# EasyEDA Pro project ProPrj_Rak11310v3b_2025-04-18.epro, schematic Schematic1
Board Name: Board1; Create Date: 2025-02-04; Page Name: P2; Project Name: Rak11310v3b; Schematic Name: Schematic1; Update Date: 2025-03-11; Company: EasyEDA.com; Drawn: EasyEDA; Page Size: A4; Part Number: JLCPCB-002; Reviewed: EasyEDA; Version: V0.1
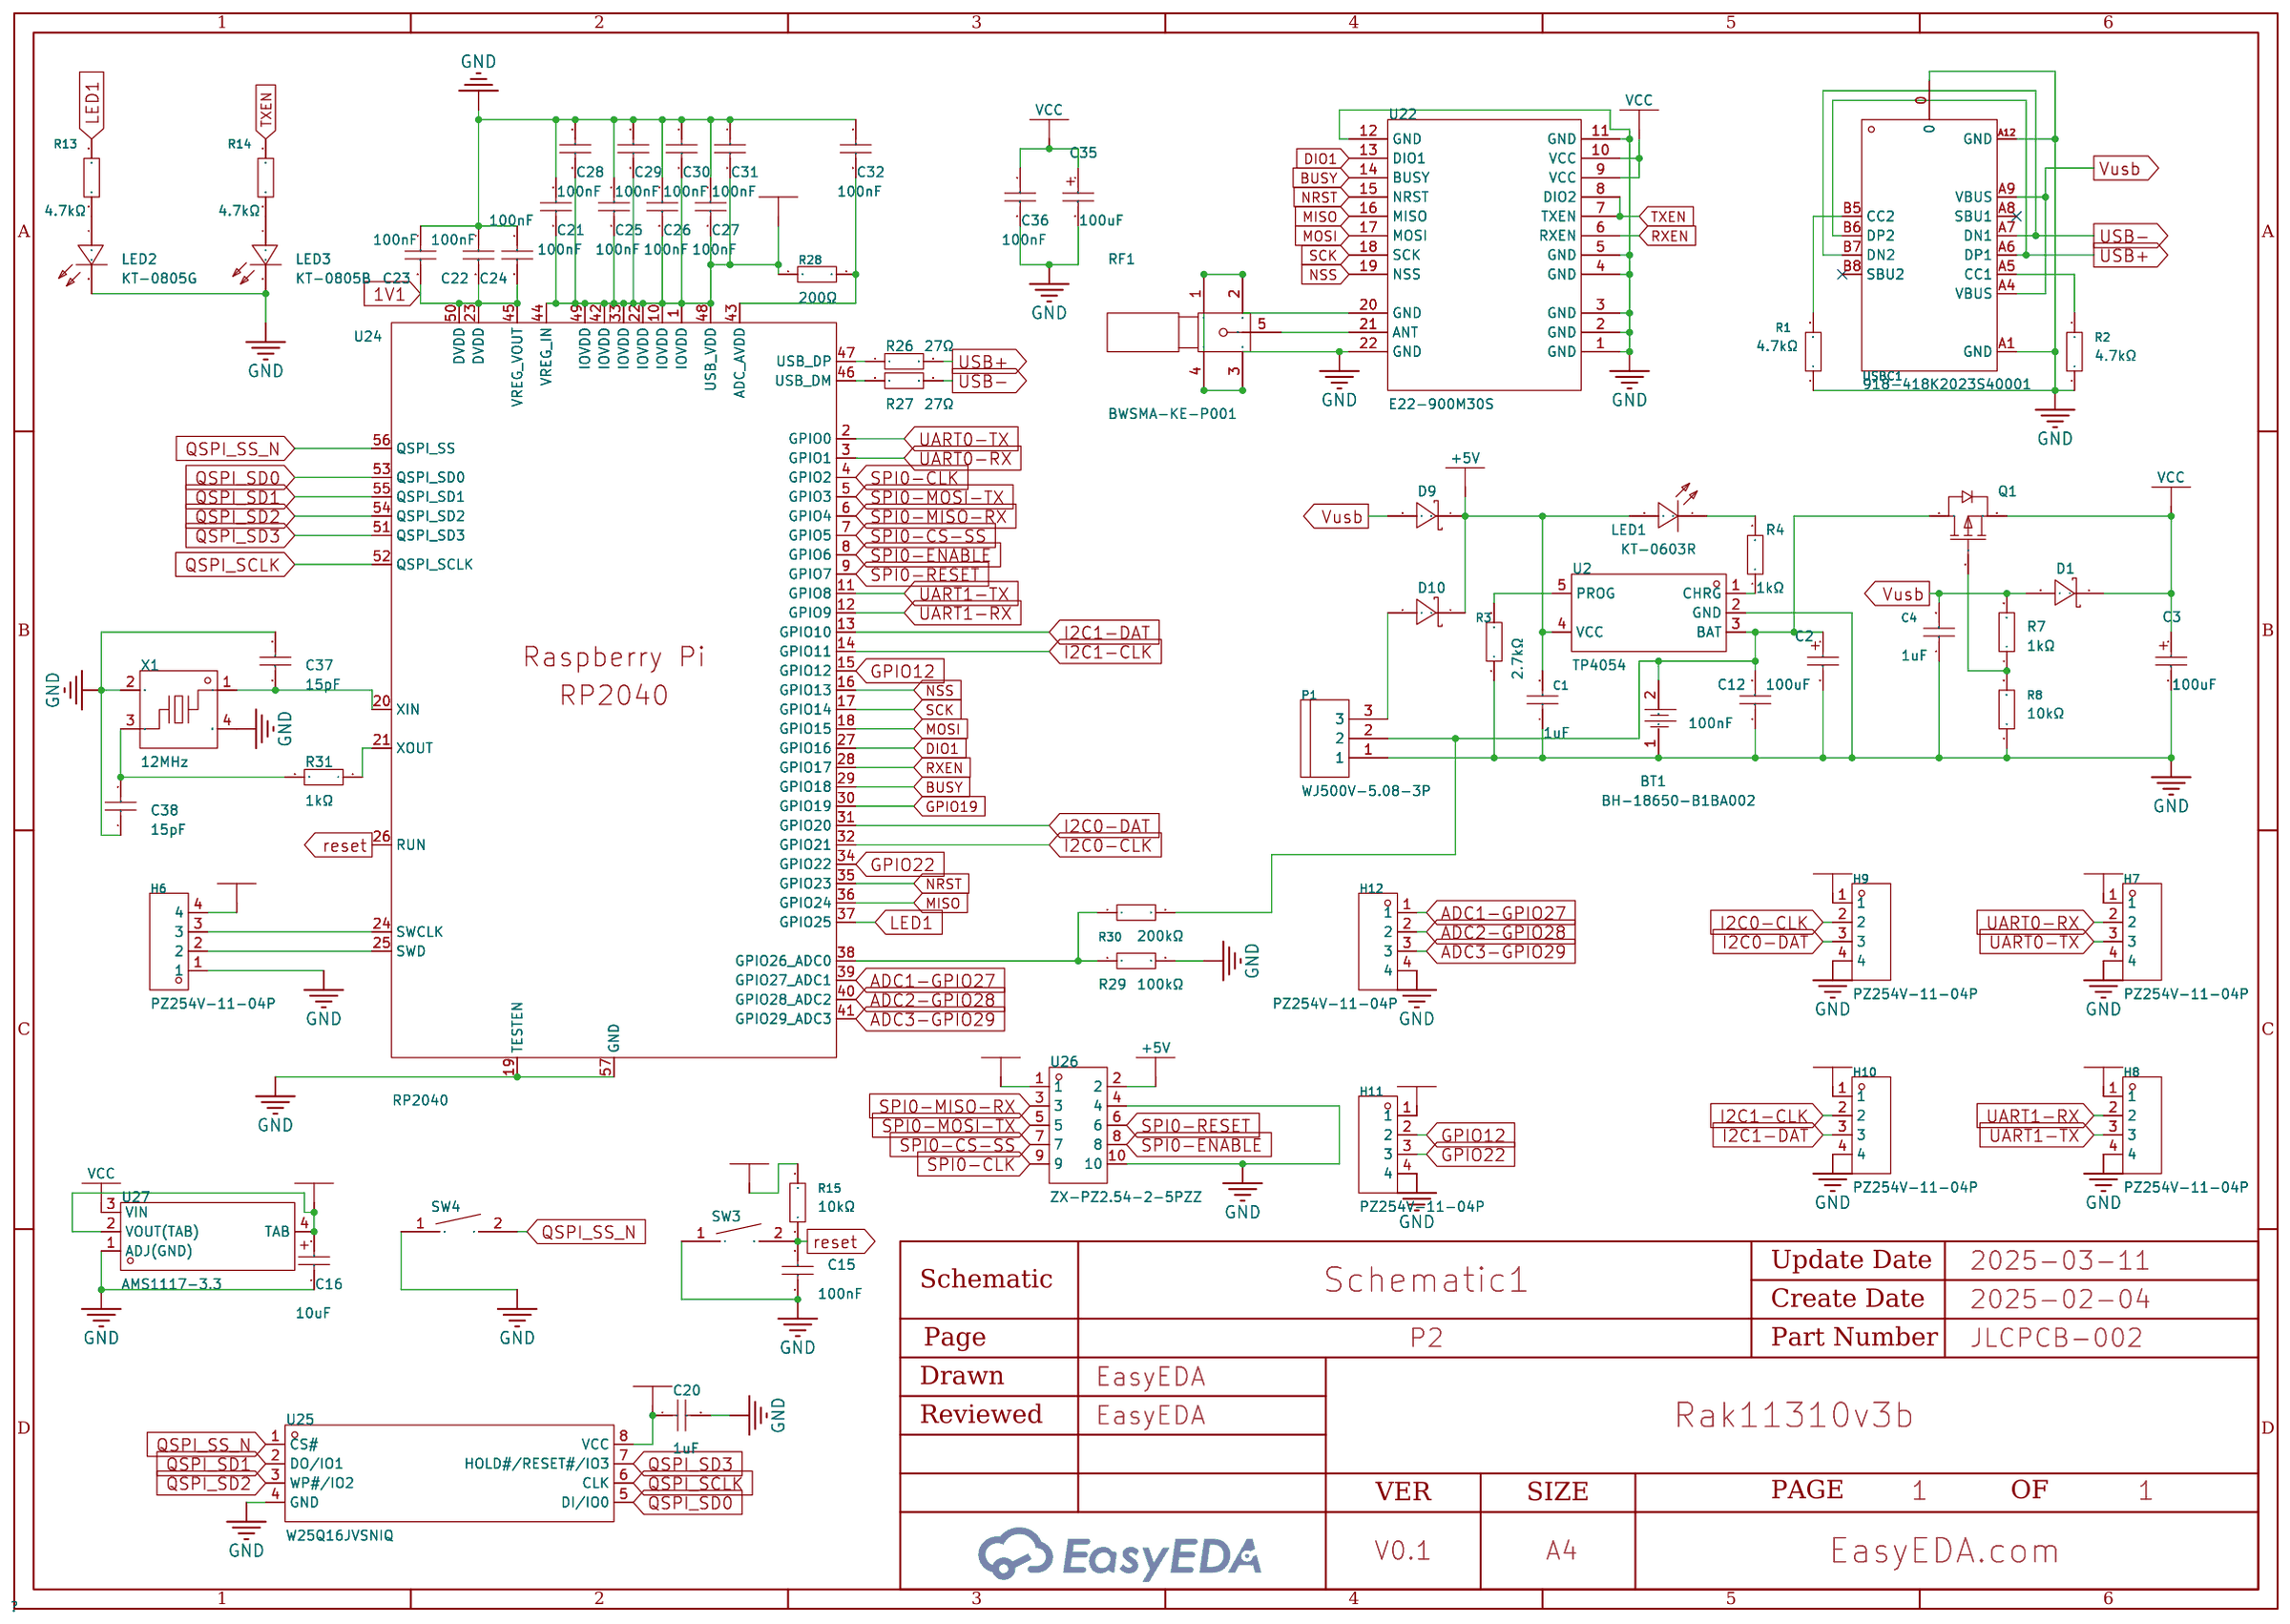
[diagram p0: schematic sheet]

## Parts
BT1  BH-18650-B1BA002  [BATTERY-SMD_18650-1S-L77.1-W20.7-1]  (no BOM)
C1  1uF  [C0805]
C2  100uF  [CASE-B_3528]
C3  100uF  [CASE-B_3528]
C4  1uF  [C0805]
C12  100nF  [C0805]
C15  100nF  [C0805]
C16  10uF  [CAP-SMD_L3.2-W1.6-RD-C7171]
C20  1uF  [C0603]
C21  100nF  [C0805]
C22  100nF  [C0805]
C23  100nF  [C0805]
C24  100nF  [C0805]
C25  100nF  [C0805]
C26  100nF  [C0805]
C27  100nF  [C0805]
C28  100nF  [C0805]
C29  100nF  [C0805]
C30  100nF  [C0805]
C31  100nF  [C0805]
C32  100nF  [C0805]
C35  100uF  [CASE-B_3528]
C36  100nF  [C0805]
C37  15pF  [C0603]
C38  15pF  [C0603]
D1  MBR140SFT1G  [SOD-123F_L2.8-W1.8-LS3.7-RD]
D9  MBR140SFT1G  [SOD-123F_L2.8-W1.8-LS3.7-RD]
D10  MBR140SFT1G  [SOD-123F_L2.8-W1.8-LS3.7-RD]
H6  PZ254V-11-04P  [HDR-TH_4P-P2.54-V-M]  (no BOM)
H7  PZ254V-11-04P  [HDR-TH_4P-P2.54-V-M]
H8  PZ254V-11-04P  [HDR-TH_4P-P2.54-V-M]
H9  PZ254V-11-04P  [HDR-TH_4P-P2.54-V-M]
H10  PZ254V-11-04P  [HDR-TH_4P-P2.54-V-M]
H11  PZ254V-11-04P  [HDR-TH_4P-P2.54-V-M]
H12  PZ254V-11-04P  [HDR-TH_4P-P2.54-V-M]
LED1  KT-0603R  [LED0603-RD]
LED2  KT-0805G  [LED0805-R-RD]
LED3  KT-0805B  [LED0805-R-RD]
P1  WJ500V-5.08-3P  [CONN-TH_3P-P5.00_WJ500V-5.08-3P]
Q1  AO3401A  [SOT-23_L2.9-W1.3-P1.90-LS2.4-BR]
R1  4.7kΩ  [R0805]
R2  4.7kΩ  [R0805]
R3  2.7kΩ  [R0805]
R4  1kΩ  [R0805]
R7  1kΩ  [R0805]
R8  10kΩ  [R0805]
R13  4.7kΩ  [R0805]
R14  4.7kΩ  [R0805]
R15  10kΩ  [R0805]
R26  27Ω  [R0603]
R27  27Ω  [R0603]
R28  200Ω  [R0603]
R29  100kΩ  [R0603]
R30  200kΩ  [R0603]
R31  1kΩ  [R0805]
RF1  BWSMA-KE-P001  [SMA-SMD_BWSMA-KE-P001]
SW3  TSA343G00D-250J2  [SW-SMD_L4.0-W2.9-P4.15-EH]
SW4  TSA343G00D-250J2  [SW-SMD_L4.0-W2.9-P4.15-EH]
U2  TP4054  [SOT-23-5_L2.9-W1.6-P0.95-LS2.8-BR]
U22  E22-900M30S  [WIRELM-SMD_E22-900M30S]
U24  RP2040  [LQFN-56_L7.0-W7.0-P0.4-EP]
U25  W25Q16JVSNIQ  [SOP-8_L4.9-W3.9-P1.27-LS6.0-BL]
U26  ZX-PZ2.54-2-5PZZ  [HDR-TH_10P-P2.54-V-M-R2-C5-S2.54]
U27  AMS1117-3.3  [SOT-223-4_L6.5-W3.5-P2.30-LS7.0-BR]
USBC1  918-418K2023S40001  [USB-C-SMD_TYPE-C-USB-17]
X1  12MHz  [OSC-SMD_4P-L3.2-W2.5-BL]

## Library data of the parts
BT1 = BH-18650-B1BA002: Connector Type:Battery case Battery Type:18650; LCSC Part Name: 电池盒 适用电池:18650; Supplier Part: C2988620; Manufacturer: MYOUNG(美阳); Supplier Footprint: SMD; JLCPCB Part Class: Extended Part; Datasheet: https://atta.szlcsc.com/upload/public/pdf/source/20220402/870DB99AB50CA0DF8D51CF7C86A51FAB.pdf; Supplier: LCSC; Connector Type: Battery case; Battery Type: 18650
C1 C4 = CL21B105KBFNNNE: Capacitance: Tolerance:±10% Tolerance:±10% Voltage Rated: Temperature Coefficient:; LCSC Part Name: 1uF ±10% 50V; Supplier Part: C28323; Manufacturer: SAMSUNG(三星); Supplier Footprint: 0805; JLCPCB Part Class: Basic Part; Datasheet: https://atta.szlcsc.com/upload/public/pdf/source/20160218/1457707763339.pdf; Supplier: LCSC; Tolerance: ±10%
C2 C3 C35 = TAJB107K006RNJ: Capacitance: Tolerance:±10% Tolerance:±10% Rated Voltage: Equivalent Series Resistance(ESR):1.7Ω@100kHz Operating Temperature:-55℃~+125℃ Operating Temperature:-55℃~+125℃; LCSC Part Name: 100uF ±10% 6.3V; Supplier Part: C16133; Manufacturer: Kyocera AVX; Supplier Footprint: CASE-B-3528; JLCPCB Part Class: Basic Part; Datasheet: https://atta.szlcsc.com/upload/public/pdf/source/20160107/1457707750344.pdf; Supplier: LCSC; Tolerance: ±10%; Equivalent Series Resistance(ESR): 1.7Ω@100kHz; Operating Temperature: -55℃~+125℃
C12 C15 C21-C32 C36 = CC0805KRX7R9BB104: Capacitance: Tolerance:±10% Tolerance:±10% Voltage Rated: Temperature Coefficient:; LCSC Part Name: 100nF ±10% 50V; Supplier Part: C49678; Manufacturer: YAGEO(国巨); Supplier Footprint: 0805; JLCPCB Part Class: Basic Part; Datasheet: https://atta.szlcsc.com/upload/public/pdf/source/20180224/C181747_15194369449651363981.pdf; Supplier: LCSC; Tolerance: ±10%
C16 = TAJA106K016RNJ: Capacitance: Tolerance:±10% Tolerance:±10% Rated Voltage: Equivalent Series Resistance(ESR):3Ω@100kHz Operating Temperature:-55℃~+125℃ Operating Temperature:-55℃~+125℃; LCSC Part Name: 10uF ±10% 16V; Supplier Part: C7171; Manufacturer: Kyocera AVX; Supplier Footprint: CASE-A-3216; JLCPCB Part Class: Basic Part; Datasheet: https://atta.szlcsc.com/upload/public/pdf/source/20160107/1457707750344.pdf; Supplier: LCSC; Tolerance: ±10%; Equivalent Series Resistance(ESR): 3Ω@100kHz; Operating Temperature: -55℃~+125℃
C20 = CL10A105KO8NNNC: Capacitance: Tolerance:±10% Tolerance:±10% Voltage Rated: Temperature Coefficient:; LCSC Part Name: 1uF ±10% 16V; Supplier Part: C1592; Manufacturer: SAMSUNG(三星); Supplier Footprint: 0603; JLCPCB Part Class: Extended Part; Datasheet: https://atta.szlcsc.com/upload/public/pdf/source/20220919/9FBE606BE0D9532D730F292EB26DC5BB.pdf; Supplier: LCSC; Tolerance: ±10%
C37 C38 = CL10C150JB8NNNC: Capacitance: Tolerance:±5% Tolerance:±5% Voltage Rated: Temperature Coefficient:; LCSC Part Name: 15pF ±5% 50V; Supplier Part: C1644; Manufacturer: SAMSUNG(三星); Supplier Footprint: 0603; JLCPCB Part Class: Basic Part; Datasheet: https://atta.szlcsc.com/upload/public/pdf/source/20160218/1457707763339.pdf; Supplier: LCSC; Tolerance: ±5%
D1 D9 D10 = MBR140SFT1G: Forward Voltage (Vf@If):550mV@1A Reverse Voltage (Vr):40V Average Rectified Current (Io):1A Reverse Leakage Current (Ir):500uA@40V; LCSC Part Name: 电压:40V 电流:1A; Supplier Part: C43381; Manufacturer: onsemi(安森美); Supplier Footprint: SOD-123FL; JLCPCB Part Class: Extended Part; Datasheet: https://atta.szlcsc.com/upload/public/pdf/source/20180125/C152277_15168647696701302597.pdf; Supplier: LCSC; Forward Voltage (Vf@If): 550mV@1A; Reverse Voltage (Vr): 40V; Average Rectified Current (Io): 1A; Reverse Leakage Current (Ir): 500uA@40V
H6-H12 = PZ254V-11-04P: Pin Structure:1x4P Pitch:2.54mm Row Spacing:- Circluar Pins/Square Pins:Square Pins Mounting Type:Straight Number of Rows:Plugin Number of Pins:4P Current Rating (Max):3A Voltage Rating (Max):250V Length of Mating Pin:6mm Insulation Height:2.5mm Length of; LCSC Part Name: 间距:2.54mm 1x4P 直插 方针; Supplier Part: C2691448; Manufacturer: XFCN(兴飞); Supplier Footprint: 插件,P=2.54mm; JLCPCB Part Class: Extended Part; Datasheet: https://atta.szlcsc.com/upload/public/pdf/source/20200309/C492403_F9F19131791D08044AD4F84F8E751A34.pdf; Supplier: LCSC; Pin Structure: 1x4P; Pitch: 2.54mm; Circluar Pins/Square Pins: Square Pins; Mounting Type: Straight; Number of Rows: Plugin; Number of Pins: 4P; Current Rating (Max): 3A; Voltage Rating (Max): 250V; Length of Mating Pin: 6mm; Insulation Height: 2.5mm; Length of End Connection Pin: 3mm; Operating Temperature Range: -40℃~+105℃; Color: Black; Check: true
LED1 = KT-0603R: Emitted Color:Red Power Dissipation:- Forward Current:- Dominant Wavelength:- Dominant Wavelength:- Peak Wavelength:- Diode Configuration:- Lens Color:- Color Temperature:- Color Temperature:- Viewing Angle:- Mounting Sytle:- Operating Temperature:-40℃~+8; LCSC Part Name: 0603 红灯 高亮; Supplier Part: C2286; Manufacturer: KENTO; Supplier Footprint: 0603; JLCPCB Part Class: Basic Part; Datasheet: https://atta.szlcsc.com/upload/public/pdf/source/20160616/1466072038404.pdf; Supplier: LCSC; Emitted Color: Red; Operating Temperature: -40℃~+85℃
LED2 = KT-0805G: Lamp Holder Type:- Emitted Color:Emerald Forward Voltage (VF):- Forward Voltage (VF):- Power Dissipation:- Forward Current:- Dominant Wavelength:- Dominant Wavelength:- Peak Wavelength:- Diode Configuration:- Lens Color:- Color Temperature:- Color Tempera; LCSC Part Name: 0805 翠绿 高亮; Supplier Part: C2297; Manufacturer: KENTO; Supplier Footprint: 0805; JLCPCB Part Class: Basic Part; Datasheet: https://atta.szlcsc.com/upload/public/pdf/source/20170209/1486607340485.pdf; Supplier: LCSC; Emitted Color: Emerald
LED3 = KT-0805B: LCSC Part Name: 0805 蓝灯 高亮; Supplier Part: C2293; Manufacturer: KENTO; Supplier Footprint: 0805; JLCPCB Part Class: Extended Part; Datasheet: https://atta.szlcsc.com/upload/public/pdf/source/20150723/1457707334170.pdf; Supplier: LCSC
P1 = WJ500V-5.08-3P: Structure:1x3P Pitch:5.08mm Color:Green Mounting Style:Straight Current Rating (Max):18A Voltage Rating (Max):250V Number of Pins:3P Number of Rows:1 Wire Gauge - AWG:14~30 Wire Gauge - AWG:14~30 Wire Gauge - mm2:2.5 Wire Gauge - mm2:2.5 Number of PINs Pe; LCSC Part Name: 5.08mm 1x3P 排数:1 每排P数:3 直插; Supplier Part: C72334; Manufacturer: KANGNEX(康奈克斯电气); Supplier Footprint: 插件,P=5.08mm; JLCPCB Part Class: Extended Part; Datasheet: https://atta.szlcsc.com/upload/public/pdf/source/20191225/C72334_8A5EF831D67650233B6B1E3F2BC06274.pdf; Supplier: LCSC; Structure: 1x3P; Pitch: 5.08mm; Color: Green; Mounting Style: Straight; Current Rating (Max): 18A; Voltage Rating (Max): 250V; Number of Pins: 3P; Number of Rows: 1; Wire Gauge - AWG: 14~30; Wire Gauge - mm2: 2.5; Number of PINs Per Row: 3; Operating Temperature Range: -40℃~+105℃
Q1 = AO3401A_C15127: Type:1个PChannel Drain Source Voltage (Vdss): Continuous Drain Current (Id): Power Dissipation (Pd): Drain Source On Resistance (RDS(on)@Vgs,Id):44mΩ@10V,4.3A Gate Threshold Voltage (Vgs(th)@Id):1.3V@250uA Total Gate Charge (Qg@Vgs):12.2nC@4.5V Input Capac; LCSC Part Name: 1个P沟道 耐压:30V 电流:4A; Supplier Part: C15127; Manufacturer: AOS; Supplier Footprint: SOT-23; JLCPCB Part Class: Basic Part; Datasheet: https://atta.szlcsc.com/upload/public/pdf/source/20160507/1462613609053.pdf; Supplier: LCSC; Type: 1个PChannel; Drain Source On Resistance (RDS(on)@Vgs,Id): 44mΩ@10V,4.3A; Gate Threshold Voltage (Vgs(th)@Id): 1.3V@250uA; Total Gate Charge (Qg@Vgs): 12.2nC@4.5V; Input Capacitance (Ciss@Vds): 1.2nF@15V; Operating Temperature: -55℃~+150℃@(Tj)
R1 R2 R13 R14 = 0805W8F4701T5E: Type:Thick Film Resistors Resistance:4.7kΩ Tolerance:±1% Tolerance:±1% Power(Watts): Overload Voltage (Max): Temperature Coefficient:±100ppm/℃ Temperature Coefficient:±100ppm/℃ Operating Temperature Range:-55℃~+155℃ Operating Temperature Range:-55℃~+155℃; LCSC Part Name: 4.7kΩ ±1% 125mW 厚膜电阻; Supplier Part: C17673; Manufacturer: UNI-ROYAL(厚声); Supplier Footprint: 0805; JLCPCB Part Class: Basic Part; Datasheet: https://atta.szlcsc.com/upload/public/pdf/source/20200306/C422600_1E6D84923E4A46A82E41ADD87F860B5C.pdf; Supplier: LCSC; Type: Thick Film Resistors; Tolerance: ±1%; Temperature Coefficient: ±100ppm/℃; Operating Temperature Range: -55℃~+155℃
R3 = 0805W8F2701T5E: Type:Thick Film Resistors Resistance:2.7kΩ Tolerance:±1% Tolerance:±1% Power(Watts): Overload Voltage (Max): Temperature Coefficient:±100ppm/℃ Temperature Coefficient:±100ppm/℃ Operating Temperature Range:-55℃~+155℃ Operating Temperature Range:-55℃~+155℃; LCSC Part Name: 2.7kΩ ±1% 125mW 厚膜电阻; Supplier Part: C17530; Manufacturer: UNI-ROYAL(厚声); Supplier Footprint: 0805; JLCPCB Part Class: Basic Part; Datasheet: https://atta.szlcsc.com/upload/public/pdf/source/20200306/C422600_1E6D84923E4A46A82E41ADD87F860B5C.pdf; Supplier: LCSC; Type: Thick Film Resistors; Tolerance: ±1%; Temperature Coefficient: ±100ppm/℃; Operating Temperature Range: -55℃~+155℃
R4 R7 R31 = 0805W8F1001T5E: Type:Thick Film Resistors Resistance:1kΩ Tolerance:±1% Tolerance:±1% Power(Watts): Overload Voltage (Max): Temperature Coefficient:±100ppm/℃ Temperature Coefficient:±100ppm/℃ Operating Temperature Range:-55℃~+155℃ Operating Temperature Range:-55℃~+155℃; LCSC Part Name: 1kΩ ±1% 125mW 厚膜电阻; Supplier Part: C17513; Manufacturer: UNI-ROYAL(厚声); Supplier Footprint: 0805; JLCPCB Part Class: Basic Part; Datasheet: https://atta.szlcsc.com/upload/public/pdf/source/20200306/C422600_1E6D84923E4A46A82E41ADD87F860B5C.pdf; Supplier: LCSC; Type: Thick Film Resistors; Tolerance: ±1%; Temperature Coefficient: ±100ppm/℃; Operating Temperature Range: -55℃~+155℃
R8 R15 = 0805W8F1002T5E: Type:Thick Film Resistors Resistance:10kΩ Tolerance:±1% Tolerance:±1% Power(Watts): Overload Voltage (Max): Temperature Coefficient:±100ppm/℃ Temperature Coefficient:±100ppm/℃ Operating Temperature Range:-55℃~+155℃ Operating Temperature Range:-55℃~+155℃; LCSC Part Name: 10kΩ ±1% 125mW 厚膜电阻; Supplier Part: C17414; Manufacturer: UNI-ROYAL(厚声); Supplier Footprint: 0805; JLCPCB Part Class: Basic Part; Datasheet: https://atta.szlcsc.com/upload/public/pdf/source/20200306/C422600_1E6D84923E4A46A82E41ADD87F860B5C.pdf; Supplier: LCSC; Type: Thick Film Resistors; Tolerance: ±1%; Temperature Coefficient: ±100ppm/℃; Operating Temperature Range: -55℃~+155℃
R26 R27 = 0603WAF270JT5E: Type:Thick Film Resistors Resistance:27Ω Tolerance:±1% Tolerance:±1% Power(Watts): Overload Voltage (Max): Temperature Coefficient:±200ppm/℃ Temperature Coefficient:±200ppm/℃ Operating Temperature Range:-55℃~+155℃ Operating Temperature Range:-55℃~+155℃; LCSC Part Name: 27Ω ±1% 100mW 厚膜电阻; Supplier Part: C25190; Manufacturer: UNI-ROYAL(厚声); Supplier Footprint: 0603; JLCPCB Part Class: Extended Part; Datasheet: https://atta.szlcsc.com/upload/public/pdf/source/20200306/C422600_1E6D84923E4A46A82E41ADD87F860B5C.pdf; Supplier: LCSC; Type: Thick Film Resistors; Tolerance: ±1%; Temperature Coefficient: ±200ppm/℃; Operating Temperature Range: -55℃~+155℃
R28 = 0603WAF2000T5E: Type:Thick Film Resistors Resistance: Tolerance:±1% Tolerance:±1% Power(Watts): Overload Voltage (Max): Temperature Coefficient:±100ppm/℃ Temperature Coefficient:±100ppm/℃ Operating Temperature Range:-55℃~+155℃ Operating Temperature Range:-55℃~+155℃; LCSC Part Name: 200Ω ±1% 100mW 厚膜电阻; Supplier Part: C8218; Manufacturer: UNI-ROYAL(厚声); Supplier Footprint: 0603; JLCPCB Part Class: Basic Part; Datasheet: https://atta.szlcsc.com/upload/public/pdf/source/20200306/C422600_1E6D84923E4A46A82E41ADD87F860B5C.pdf; Supplier: LCSC; Type: Thick Film Resistors; Tolerance: ±1%; Temperature Coefficient: ±100ppm/℃; Operating Temperature Range: -55℃~+155℃
R29 = 0603WAF1003T5E: Type:Thick Film Resistors Resistance:100kΩ Tolerance:±1% Tolerance:±1% Power(Watts): Overload Voltage (Max): Temperature Coefficient:±100ppm/℃ Temperature Coefficient:±100ppm/℃ Operating Temperature Range:-55℃~+155℃ Operating Temperature Range:-55℃~+155℃; LCSC Part Name: 100kΩ ±1% 100mW 厚膜电阻; Supplier Part: C25803; Manufacturer: UNI-ROYAL(厚声); Supplier Footprint: 0603; JLCPCB Part Class: Basic Part; Datasheet: https://atta.szlcsc.com/upload/public/pdf/source/20200306/C422600_1E6D84923E4A46A82E41ADD87F860B5C.pdf; Supplier: LCSC; Type: Thick Film Resistors; Tolerance: ±1%; Temperature Coefficient: ±100ppm/℃; Operating Temperature Range: -55℃~+155℃
R30 = 0603WAF2003T5E: Type:Thick Film Resistors Resistance:200kΩ Tolerance:±1% Tolerance:±1% Power(Watts): Overload Voltage (Max): Temperature Coefficient:±100ppm/℃ Temperature Coefficient:±100ppm/℃ Operating Temperature Range:-55℃~+155℃ Operating Temperature Range:-55℃~+155℃; LCSC Part Name: 200kΩ ±1% 100mW 厚膜电阻; Supplier Part: C25811; Manufacturer: UNI-ROYAL(厚声); Supplier Footprint: 0603; JLCPCB Part Class: Basic Part; Datasheet: https://atta.szlcsc.com/upload/public/pdf/source/20200306/C422600_1E6D84923E4A46A82E41ADD87F860B5C.pdf; Supplier: LCSC; Type: Thick Film Resistors; Tolerance: ±1%; Temperature Coefficient: ±100ppm/℃; Operating Temperature Range: -55℃~+155℃
RF1 = BWSMA-KE-P001: Connector Type:Board-End Interface Type:Inner Hole Number of Ports:1 Interface Diameter:5.2mm Interface Length/Height:- Frequency-Max:- RF Series:SMA Impedance:50Ω Style:Staggered pins Operating Temperature Range:- Operating Temperature Range:-; LCSC Part Name: 内孔 SMA 偏脚; Supplier Part: C496550; Manufacturer: BAT WIRELESS(蝙蝠无线); Supplier Footprint: SMD; JLCPCB Part Class: Extended Part; Datasheet: https://atta.szlcsc.com/upload/public/pdf/source/20240320/28FD502871C976DFF213ABFCF2A0ED51.pdf; Supplier: LCSC; Connector Type: Board-End; Interface Type: Inner Hole; Number of Ports: 1; Interface Diameter: 5.2mm; RF Series: SMA; Impedance: 50Ω; Style: Staggered pins
SW3 SW4 = TSA343G00D-250J2: Circuit:SPST Actuator Style:Round Button Operating Force:250gf Mounting Style:Standing paste Switch Length:4mm Switch Width:3mm Switch Height:2mm Strike Gundam:Without Contact Current:50mA Voltage Rating (DC):12V Insulation Resistance:100MΩ Actuator/Cap C; LCSC Part Name: 4x3x2mm两脚小龟 带柱 立贴 轻触开关; Supplier Part: C354947; Manufacturer: BRIGHT(博瑞泰); Supplier Footprint: SMD; JLCPCB Part Class: Extended Part; Datasheet: https://atta.szlcsc.com/upload/public/pdf/source/20190426/C354947_F1C4B323DD8D3B81255E73F8FD6ABFD3.pdf; Supplier: LCSC; Circuit: SPST; Actuator Style: Round Button; Operating Force: 250gf; Mounting Style: Standing paste; Switch Length: 4mm; Switch Width: 3mm; Switch Height: 2mm; Strike Gundam: Without; Contact Current: 50mA; Voltage Rating (DC): 12V; Insulation Resistance: 100MΩ; Actuator/Cap Color: Black; With Lamp: None; Pin Style: SMDSplicing; Mechanical Life: 50,000 Times; Operating Temperature: -25℃~+70℃
U2 = TP4054_C5381776: The Chip Type:电池管理 Supply Voltage:4V~9V Supply Voltage:4V~9V Maximum Charge Current:800mA Type of Battery:锂离子/Polymer Number of Cells:1 Number of Cells:1 Operating Temperature:-40℃~+85℃ Operating Temperature:-40℃~+85℃; Supplier Part: C5381776; Manufacturer: JSMSEMI(杰盛微); Supplier Footprint: SOT-23-5; JLCPCB Part Class: Extended Part; Datasheet: https://atta.szlcsc.com/upload/public/pdf/source/20240105/B23E77B3239CBD8CB006536E3C384378.pdf; Supplier: LCSC; The Chip Type: 电池管理; Supply Voltage: 4V~9V; Maximum Charge Current: 800mA; Type of Battery: 锂离子/Polymer; Number of Cells: 1; Operating Temperature: -40℃~+85℃
U22 = E22-900M30S: Supplier Part: C411294; Manufacturer: EBYTE(亿佰特); Supplier Footprint: SMD,24x38.5mm; JLCPCB Part Class: Extended Part; Datasheet: https://atta.szlcsc.com/upload/public/pdf/source/20190812/C411294_87C350FB6BB2C6BF251F36B5C2EFC8FF.pdf; Supplier: LCSC
U24 = RP2040_C2040: CPU Core:- RAM Size:264KB GPIO Ports Number:30 Operating Voltage Range:- Operating Voltage Range:- CPU Maximum Speed:133MHz Program Memory Type:- Operating Temperature Range:- Operating Temperature Range:- ADC (Bit):12bit DAC (Bit):- PWM (Bit):- 8Bit Time; LCSC Part Name: RP2040（RP2B2）; Supplier Part: C2040; Manufacturer: Raspberry Pi(树莓派); Supplier Footprint: LQFN-56(7x7); JLCPCB Part Class: Extended Part; Datasheet: https://atta.szlcsc.com/upload/public/pdf/source/20210621/C2040_96F425825606B7957D87DD32E2512CA9.pdf; Supplier: LCSC; RAM Size: 264KB; GPIO Ports Number: 30; CPU Maximum Speed: 133MHz; ADC (Bit): 12bit; UART/USART: 2; I2C: 2; SPI: 2; Universal Serial Bus: 有; Peripheral/Function: DMA；PWM; Direct Memory Access: 有
U25 = W25Q16JVSNIQ_C2456211: Supplier Part: qspi ss patte 56 sd0; Manufacturer: WINBOND(华邦); Supplier Footprint: SOIC-8; JLCPCB Part Class: Extended Part; Datasheet: https://atta.szlcsc.com/upload/public/pdf/source/20190529/C115407_78E5B4F96E7138D299EC51EC5982A1A5.pdf; Supplier: LCSC
U26 = ZX-PZ2.54-2-5PZZ: Pin Structure:2x5P Pitch:2.54mm Row Spacing:2.54mm Circluar Pins/Square Pins:Square Pins Mounting Type:Straight Number of Rows:双排 Number of Pins:10P Current Rating (Max):3A Voltage Rating (Max):1kV Length of Mating Pin:6mm Insulation Height:2.5mm Length o; LCSC Part Name: 2x5P 间距:2.54mm 方针 直插; Supplier Part: C7501276; Manufacturer: Megastar(兆星); Supplier Footprint: 插件,P=2.54mm; JLCPCB Part Class: Extended Part; Datasheet: https://atta.szlcsc.com/upload/public/pdf/source/20231122/7DD2FA5A7FDBC10CDDB6051CB6BC6AD1.pdf; Supplier: LCSC; Pin Structure: 2x5P; Pitch: 2.54mm; Row Spacing: 2.54mm; Circluar Pins/Square Pins: Square Pins; Mounting Type: Straight; Number of Rows: 双排; Number of Pins: 10P; Current Rating (Max): 3A; Voltage Rating (Max): 1kV; Length of Mating Pin: 6mm; Insulation Height: 2.5mm; Length of End Connection Pin: 3mm; Contact Plating: Gold; Operating Temperature Range: -40℃~+105℃; Color: Black
U27 = AMS1117-3.3_C347222: Output Type:Fixed Maximum Input Voltage:12V Output Voltage:3.3V Output Voltage:3.3V Output Current:1A Power Supply Rejection Ratio (PSRR):60dB@(120Hz) Dropout Voltage:1.3V@(1A) standby current:- Noise:- Feature:Overcurrent Protection(OCP) Operating Temper; LCSC Part Name: 输出:3.3V 电流:1A 耐压:12V; Supplier Part: C347222; Manufacturer: UMW(友台半导体); Supplier Footprint: SOT-223; JLCPCB Part Class: Extended Part; Datasheet: https://atta.szlcsc.com/upload/public/pdf/source/20241218/BAF0263FA2E44BCD8AF41AA4FA04EFAA.pdf; Supplier: LCSC; Output Type: Fixed; Maximum Input Voltage: 12V; Output Voltage: 3.3V; Output Current: 1A; Power Supply Rejection Ratio (PSRR): 60dB@(120Hz); Dropout Voltage: 1.3V@(1A); Feature: Overcurrent Protection(OCP); Output Polarity: Positive electrode; Number of Outputs: 1
USBC1 = 918-418K2023S40001: Connector Type:Type-C Standard:- Gender:Female Number of Ports:1 Number of Contacts:16P Current Rating - Power (Max):3A; LCSC Part Name: Type-C 母; Supplier Part: C167321; Manufacturer: 精拓金; Supplier Footprint: SMD; JLCPCB Part Class: Extended Part; Datasheet: https://atta.szlcsc.com/upload/public/pdf/source/20210305/C167321_3BB79E85CEB6874BF587E64926D16F83.pdf; Supplier: LCSC; Connector Type: Type-C; Gender: Female; Number of Ports: 1; Number of Contacts: 16P; Current Rating - Power (Max): 3A
X1 = XL2EL89COI-111YLC-12M: Crystal Type:Surface Mount Crystal Frequency:12MHz Normal temperature Frequency Tolerance:±10ppm Normal temperature Frequency Tolerance:±10ppm Load Capacitor: Frequency Stability:±20ppm Frequency Stability:±20ppm Operating Temperature: Operating Temperatu; LCSC Part Name: 12MHz ±10ppm 12pF YSX321SL; Supplier Part: C5280578; Manufacturer: YXC(扬兴晶振); Supplier Footprint: SMD3225-4P; JLCPCB Part Class: Extended Part; Datasheet: https://atta.szlcsc.com/upload/public/pdf/source/20240329/19D5F850207469550BEB00D7DFEDBC7A.pdf; Supplier: LCSC; Crystal Type: Surface Mount Crystal; Normal temperature Frequency Tolerance: ±10ppm; Frequency Stability: ±20ppm

## Nets
1V1: C22.2 C23.2 C24.2 U24.23(DVDD) U24.45(VREG_VOUT) U24.50(DVDD)
3.3V: C16.1 C20.1 C21.2 C25.2 C26.2 C27.2 C28.2 C29.2 C30.2 C31.2 H6.4 H7.1 H8.1 H9.1 H10.1 H11.1 R15.2 R28.1 U24.1(IOVDD) U24.10(IOVDD) U24.22(IOVDD) U24.33(IOVDD) U24.42(IOVDD) U24.44(VREG_IN) U24.48(USB_VDD) U24.49(IOVDD) U25.8(VCC) U26.1 U27.2(VOUT(TAB)) U27.4(TAB)
+5V: C1.2 D9.1(K) D10.1(K) LED1.2(A) U2.4(VCC) U26.2
GND: BT1.1 C1.1 C2.2 C3.2 C4.1 C12.1 C15.1 C16.2 C20.2 C21.1 C22.1 C23.1 C24.1 C25.1 C26.1 C27.1 C28.1 C29.1 C30.1 C31.1 C32.1 C35.2 C36.2 C37.2 C38.1 H6.1 H7.4 H8.4 H9.4 H10.4 H11.4 H12.4 LED2.2(K) LED3.2(K) P1.1 R1.1 R2.1 R3.1 R8.1 R29.2 RF1.1 RF1.2 RF1.3 RF1.4 SW3.1 SW4.1 U2.2(GND) U22.1(GND) U22.2(GND) U22.3(GND) U22.4(GND) U22.5(GND) U22.11(GND) U22.12(GND) U22.20(GND) U22.22(GND) U24.19(TESTEN) U24.57(GND) U25.4(GND) U26.4 U26.10 U27.1(ADJ(GND)) USBC1.0 USBC1.A1(GND) USBC1.A12(GND) X1.2(GND) X1.4(GND)
VCC: C3.1 C35.1 C36.1 D1.1(K) Q1.2(S) U22.9(VCC) U22.10(VCC) U27.3(VIN)
ADC1-GPIO27: H12.1 U24.39(GPIO27_ADC1)
ADC2-GPIO28: H12.2 U24.40(GPIO28_ADC2)
ADC3-GPIO29: H12.3 U24.41(GPIO29_ADC3)
BUSY: U22.14(BUSY) U24.29(GPIO18)
DIO1: U22.13(DIO1) U24.27(GPIO16)
GPIO12: H11.2 U24.15(GPIO12)
GPIO19: U24.30(GPIO19)
GPIO22: H11.3 U24.34(GPIO22)
I2C0-CLK: H9.2 U24.32(GPIO21)
I2C0-DAT: H9.3 U24.31(GPIO20)
I2C1-CLK: H10.2 U24.14(GPIO11)
I2C1-DAT: H10.3 U24.13(GPIO10)
LED1: R13.2 U24.37(GPIO25)
MISO: U22.16(MISO) U24.36(GPIO24)
MOSI: U22.17(MOSI) U24.18(GPIO15)
NRST: U22.15(NRST) U24.35(GPIO23)
NSS: U22.19(NSS) U24.16(GPIO13)
QSPI_SCLK: U24.52(QSPI_SCLK) U25.6(CLK)
QSPI_SD0: U24.53(QSPI_SD0) U25.5(DI/IO0)
QSPI_SD1: U24.55(QSPI_SD1) U25.2(DO/IO1)
QSPI_SD2: U24.54(QSPI_SD2) U25.3(WP#/IO2)
QSPI_SD3: U24.51(QSPI_SD3) U25.7(HOLD#/RESET#/IO3)
QSPI_SS_N: SW4.2 U24.56(QSPI_SS) U25.1(CS#)
reset: C15.2 R15.1 SW3.2 U24.26(RUN)
RXEN: U22.6(RXEN) U24.28(GPIO17)
SCK: U22.18(SCK) U24.17(GPIO14)
SPI0-CLK: U24.4(GPIO2) U26.9
SPI0-CS-SS: U24.7(GPIO5) U26.7
SPI0-ENABLE: U24.8(GPIO6) U26.8
SPI0-MISO-RX: U24.6(GPIO4) U26.3
SPI0-MOSI-TX: U24.5(GPIO3) U26.5
SPI0-RESET: U24.9(GPIO7) U26.6
TXEN: R14.2 U22.7(TXEN) U22.8(DIO2)
UART0-RX: H7.2 U24.3(GPIO1)
UART0-TX: H7.3 U24.2(GPIO0)
UART1-RX: H8.2 U24.12(GPIO9)
UART1-TX: H8.3 U24.11(GPIO8)
USB+: R26.2 USBC1.A6(DP1) USBC1.B6(DP2)
USB-: R27.2 USBC1.A7(DN1) USBC1.B7(DN2)
Vusb: C4.2 D1.2(A) D9.2(A) R7.2 USBC1.A4(VBUS) USBC1.A9(VBUS)
$2N12498: C37.1 U24.20(XIN) X1.1
$2N12725: R26.1 U24.47(USB_DP)
$2N12727: R27.1 U24.46(USB_DM)
$2N13721: C32.2 R28.2 U24.43(ADC_AVDD)
$2N13936: H6.2 U24.25(SWD)
$2N13938: H6.3 U24.24(SWCLK)
$2N15293: R29.1 R30.1 U24.38(GPIO26_ADC0)
$2N20056: R2.2 USBC1.A5(CC1)
$2N20057: R1.2 USBC1.B5(CC2)
$2N20240: LED3.1(A) R14.1
$2N20242: LED2.1(A) R13.1
$2N21416: R4.1 U2.1(CHRG)
$2N21417: LED1.1(K) R4.2
$2N21420: Q1.1(G) R7.1 R8.2
$2N21421: R3.2 U2.5(PROG)
$2N21422: BT1.2 C2.1 C12.2 P1.2 Q1.3(D) R30.2 U2.3(BAT)
$2N21423: D10.2(A) P1.3
$2N36053: C38.2 R31.2 X1.3
$2N36055: R31.1 U24.21(XOUT)
$2N36215: RF1.5 U22.21(ANT)

Not connected (* = marked no-connect by the designer): USBC1 A8(SBU1)* B8(SBU2)*
